# Altium schematic sheet Connectors.SchDoc: Extension connectors
size A3; DocumentNumber: MB1137; Revision: B-01; SheetNumber: 6; SheetTotal: 6; Project: NUCLEO-XXXXZX
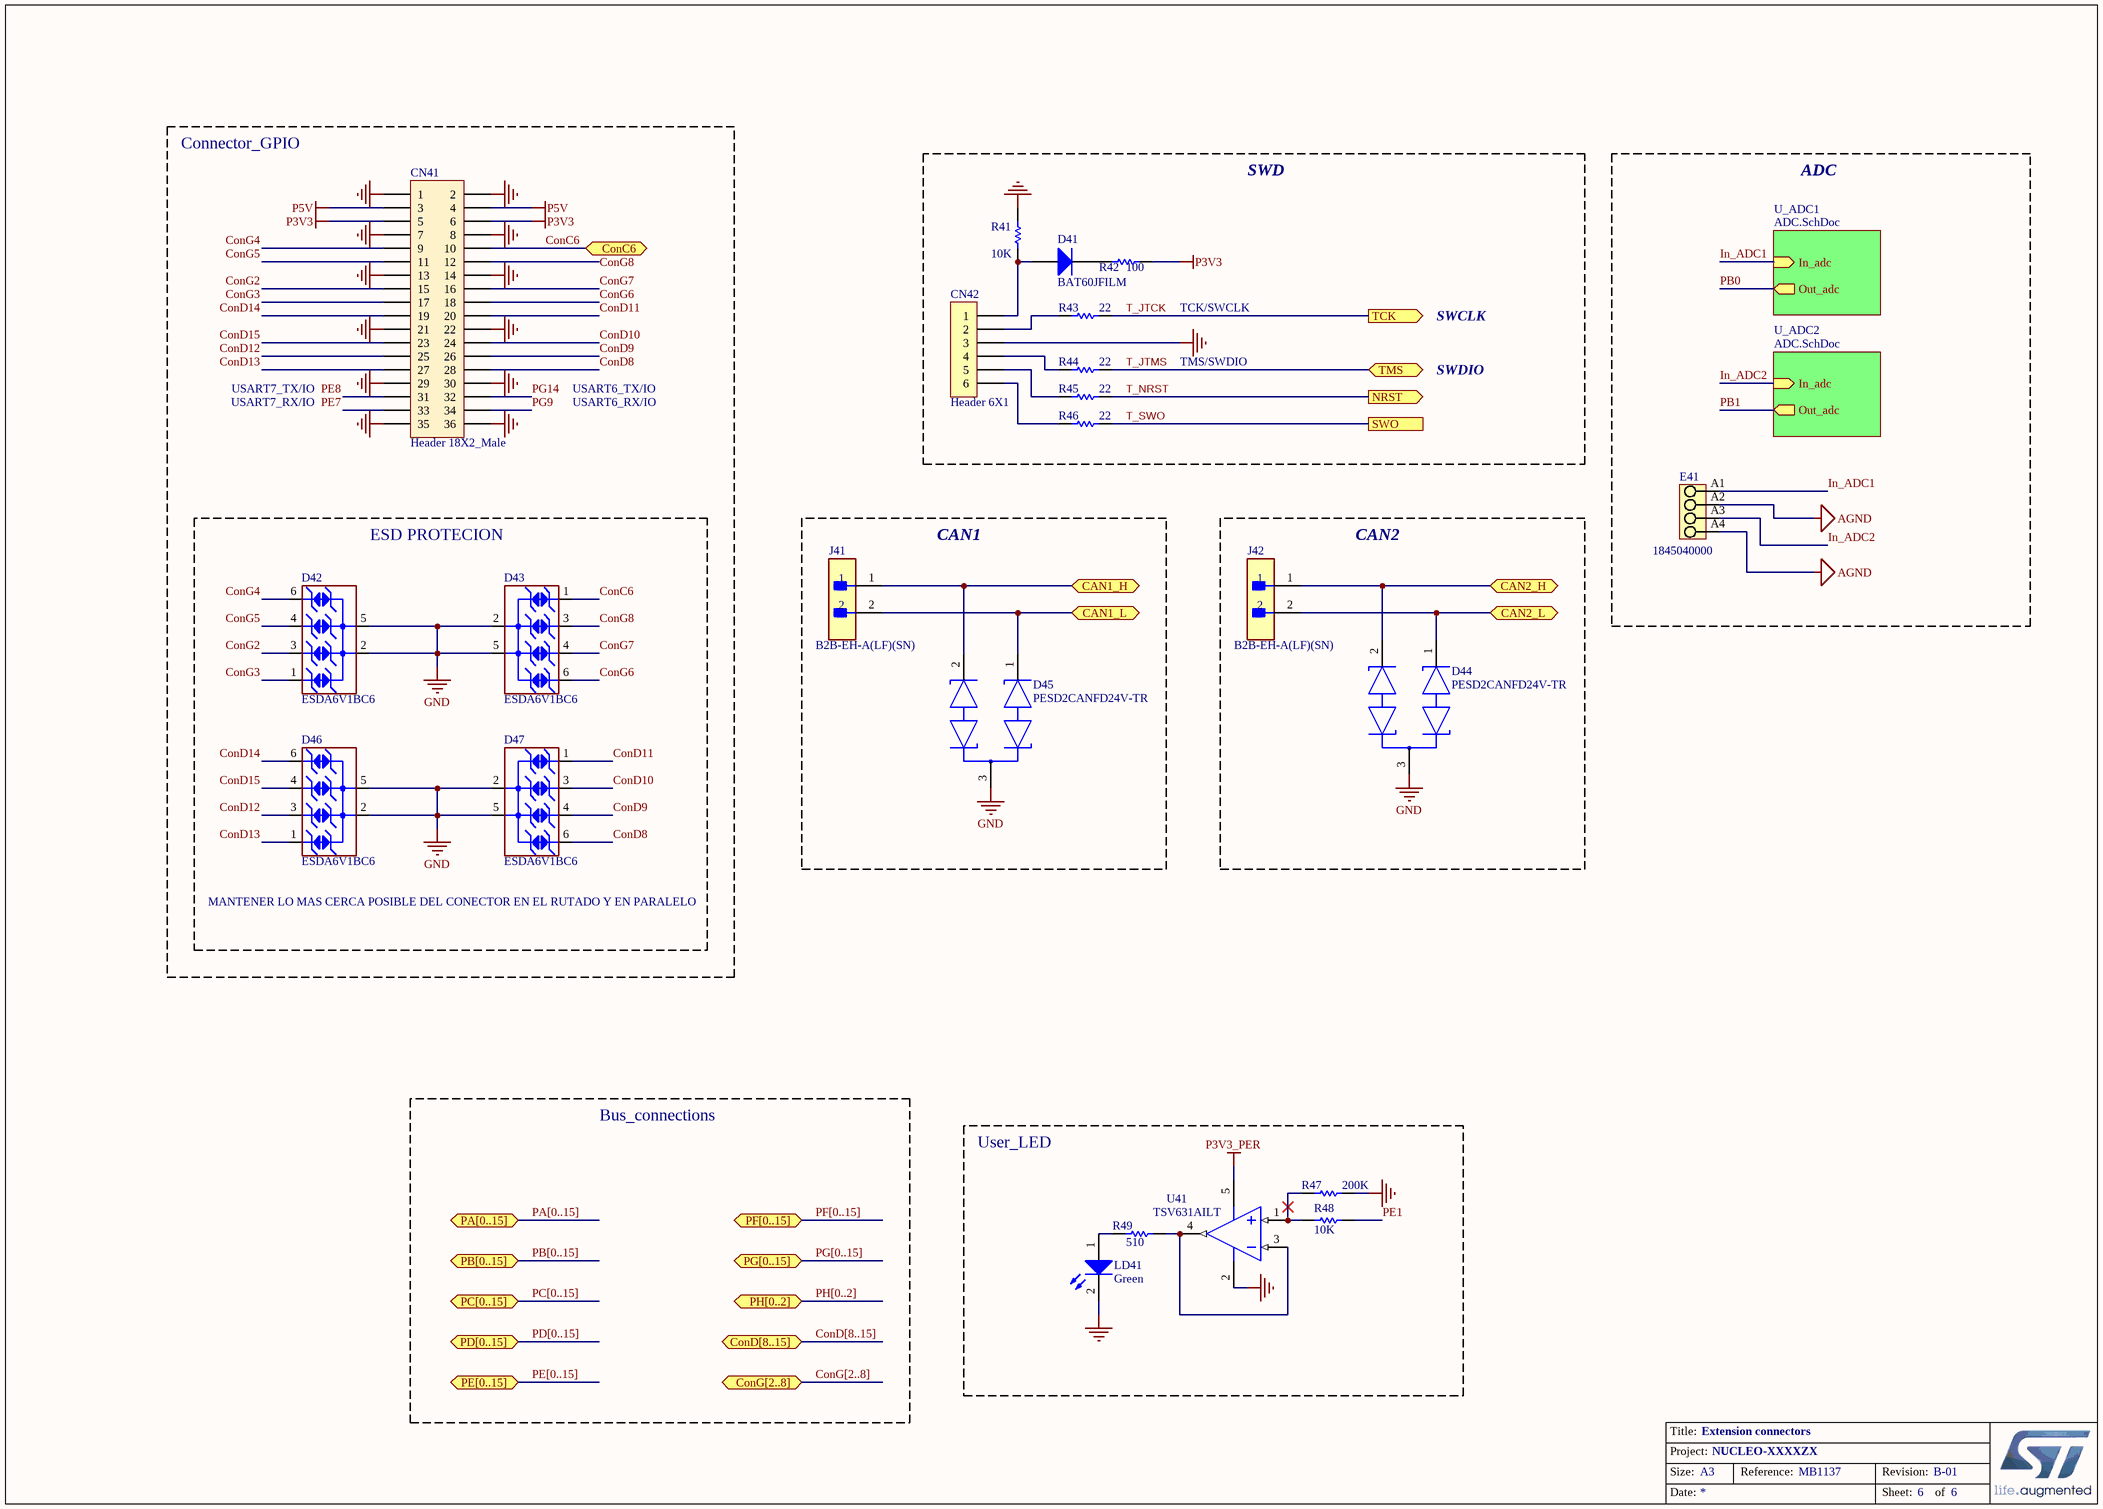
[diagram p0: Connectors.SchDoc]

## Parts
CN41  Header 18X2_Male  [HDR_2x18_2R54_V_M]
CN42  Header 6X1  [HDR_1x6_2R54_V_M]
D41  BAT60JFILM  [SOD-323]
D42  ESDA6V1BC6  [SOT23-6L]
D43  ESDA6V1BC6  [SOT23-6L]
D44  PESD2CANFD24V-TR  [FP-SOT23-IPC_A]
D45  PESD2CANFD24V-TR  [FP-SOT23-IPC_A]
D46  ESDA6V1BC6  [SOT23-6L]
D47  ESDA6V1BC6  [SOT23-6L]
E41  1845040000  [LM_3_5_90_04]
J41  B2B-EH-A(LF)(SN)  [FP-B2B-EH-A_LF_SN-MFG]
J42  B2B-EH-A(LF)(SN)  [FP-B2B-EH-A_LF_SN-MFG]
LD41  Green  [0603D-G]
R41  10K  [0603R]
R42  100  [0603R]
R43  22  [0603R]
R44  22  [0603R]
R45  22  [0603R]
R46  22  [0603R]
R47  200K  [0603R]
R48  10K  [0603R]
R49  510  [0603R]
U41  TSV631AILT  [SOT-23-5L]

## Blocks framed on the sheet
Connector_GPIO: CN41
SWD: CN42 D41 R41-R46
ADC: E41
ESD PROTECION: D42 D43 D46 D47
CAN1: D45 J41
CAN2: D44 J42
User_LED: LD41 R47-R49 U41

## Sub-sheets
U_ADC1 = ADC.SchDoc: In_adc (in), Out_adc (out)
U_ADC2 = ADC.SchDoc: In_adc (in), Out_adc (out)

## Ports
CAN1_H (bidir), CAN1_L (bidir), CAN2_H (bidir), CAN2_L (bidir), ConC6 (bidir), ConD[8..15] (bidir), ConG[2..8] (bidir), NRST (out), PA[0..15] (bidir), PB[0..15] (bidir), PC[0..15] (bidir), PD[0..15] (bidir), PE[0..15] (bidir), PF[0..15] (bidir), PG[0..15] (bidir), PH[0..2] (bidir), SWO, TCK (out), TMS (bidir)

## Nets
AGND: E41.A2 E41.A4
GND: CN41.1 CN41.2 CN41.7 CN41.8 CN41.13 CN41.14 CN41.21 CN41.22 CN41.29 CN41.30 CN41.35 CN41.36 CN42.3 D42.2(IO2) D42.5(IO4) D43.2(IO2) D43.5(IO4) D44.3(CC) D45.3(CC) D46.2(IO2) D46.5(IO4) D47.2(IO2) D47.5(IO4) LD41.2(K) R41.2 R47.2 U41.2(VDD)
P3V3: CN41.5 CN41.6 R42.2
P3V3_PER: U41.5(VCC)
P5V: CN41.3 CN41.4
CAN1_H: D45.2(K2) J41.1 ; port CAN1_H
CAN1_L: D45.1(K1) J41.2 ; port CAN1_L
CAN2_H: D44.2(K2) J42.1 ; port CAN2_H
CAN2_L: D44.1(K1) J42.2 ; port CAN2_L
ConC6: CN41.10 D43.1(IO1) ; port ConC6
ConD8: CN41.28 D47.6(NC)
ConD9: CN41.26 D47.4(IO3)
ConD10: CN41.24 D47.3(GND)
ConD11: CN41.20 D47.1(IO1)
ConD12: CN41.25 D46.3(GND)
ConD13: CN41.27 D46.1(IO1)
ConD14: CN41.19 D46.6(NC)
ConD15: CN41.23 D46.4(IO3)
ConG2: CN41.15 D42.3(GND)
ConG3: CN41.17 D42.1(IO1)
ConG4: CN41.9 D42.6(NC)
ConG5: CN41.11 D42.4(IO3)
ConG6: CN41.18 D43.6(NC)
ConG7: CN41.16 D43.4(IO3)
ConG8: CN41.12 D43.3(GND)
In_ADC1: E41.A1 ; sheet U_ADC1/In_adc
In_ADC2: E41.A3 ; sheet U_ADC2/In_adc
PB0: sheet U_ADC1/Out_adc
PB1: sheet U_ADC2/Out_adc
PE1: R48.2
PE7: CN41.33
PE8: CN41.31
PG9: CN41.34
PG14: CN41.32
T_JTCK: R43.2 ; port TCK
T_JTMS: R44.2 ; port TMS
T_NRST: R45.2 ; port NRST
T_SWO: R46.2 ; port SWO
NetCN42_1: CN42.1 D41.1(A) R41.1
NetCN42_2: CN42.2 R43.1
NetCN42_4: CN42.4 R44.1
NetCN42_5: CN42.5 R45.1
NetCN42_6: CN42.6 R46.1
NetD41_2: D41.2(K) R42.1
NetLD41_1: LD41.1(A) R49.2
NetR47_1: R47.1 R48.1 U41.1(IN+)
NetR49_1: R49.1 U41.3(IN-) U41.4(OUT)

## Buses and harness runs
bus ConD[8..15] = port ConD[8..15]
bus ConG[2..8] = port ConG[2..8]
bus PA[0..15] = port PA[0..15]
bus PB[0..15] = port PB[0..15]
bus PC[0..15] = port PC[0..15]
bus PD[0..15] = port PD[0..15]
bus PE[0..15] = port PE[0..15]
bus PF[0..15] = port PF[0..15]
bus PG[0..15] = port PG[0..15]
bus PH[0..2] = port PH[0..2]

## Notes on the sheet
- TCK/SWCLK
- SWCLK
- TMS/SWDIO
- SWDIO
- USART7_TX/IO
- USART7_RX/IO
- USART6_TX/IO
- USART6_RX/IO
- MANTENER LO MAS CERCA POSIBLE DEL CONECTOR EN EL RUTADO Y EN PARALELO
- Bus_connections
- Title:
- Project:
- Size:
- Date:
- A3
- Reference:
- Sheet:
- Revision:
- of

## Library data of the parts
CN41 = Header 18X2_Male: Header, 18-Pin, Dual row,male; Publisher: Altium Limited
CN42 = Header 6X1: Header, 6-Pin, Single row; LatestRevisionDate: 17-Jul-2002; LatestRevisionNote: Re-released for DXP Platform.; Publisher: Altium Limited
D41 = BAT60JFILM: Manuf_1: STM; Provided: ST; ECCN_US/EU: EAR99/NEC; Revision: July-2002: Re-released for DXP Platform.; Order: BAT60JFILM; Manuf_Part_1: BAT60JFILM; Distrib: ST
D42 D43 D46 D47 = ESDA6V1BC6: 4-line ESD protection; Manuf_1: STM; Manuf_Part_1: ESDA5V3L; Ref St: 9179034; Provided: ST; ECCN_US/EU: EAR99/NEC; Distrib: ST; Order: ESDA5V3L; Ordered by: STM
D44 D45 = CMP-14436-000014-1: TVS DIODE 24VWM 42VC TO236AB
E41 = CMP-1559-01732-1: OMNIMATE Signal - series LM; Manufacturer: Weidmueller; Rated_voltage_use_group_B_UL_1059: 300 V; Short_text_for_material: LM 3.50/04/90 3.2SN OR BX; Wire_cross_section_AWG_min_UL_1059: AWG 28; Pitch_mm: 3,5 mm; Solder_pin_length_mm: 3,2 mm; Contact_material: Cu-Leg; Rated_current_min_no_of_poles_TU_20_deg_C: 19 A; Rated_current_use_group_B_UL_1059: 10 A; Side_termination_characteristic: closed side; Contact_surface: tinned; UL_94_flammability_rating: V-2; Pitch_inch: 0,138 inch; Insulating_material: PA; Solid_max_H05_07_V_U: 1,5 mm²; Rated_voltage_for_surge_voltage_class_pollution_degree_II_2: 320 V; Wire_cross_section_AWG_max_UL_1059: AWG 14; Mounting_onto_the_PCB: Solder connection; Solid_min_H05_07_V_U: 0,5 mm²; No_of_poles: 4; ComponentLink2Description: URL Link1; ComponentLink2URL: http://catalog.weidmueller.com/catalog/Start.do?localeId=en&ObjectID=1845040000; Qty: 100 PCS; Packaging: Box; Revision: V1; PartNumber: 1845040000; ComponentLink1Description: Manufacturer URL; ComponentLink1URL: http://www.weidmueller.com/; PackageReference: LM_3_5_90_04; Colour: Orange
J41 J42 = CMP-17439-000026-1: CONN HEADER VERT 2POS 2.5MM; Number of Contacts: 2; Current Rating: 3A; Connector Type: Plug; Contact Resistance: 20mR; Gender: Male; Voltage Rating: 250V; Fastening Type: Detent; Depth: 3.8mm; Max Operating Temperature: 85°C; Orientation: Straight; Series: EH; Contact Plating: Tin; Min Operating Temperature: -25°C; Contact Type: Male Pin; Housing Color: White; Termination: Press-Fit; Housing Material: Nylon; Pitch: 2.5mm; Number of Positions: 2; Max Current Rating: 3A; Packaging: Bulk; Lead Free: Lead Free; Number of Rows: 1; Length: 7.5mm; Contact Mating Length: 0.13inch; Color: Natural; Max Voltage Rating (AC): 250V; Contact Material: Copper Alloy; Mount: Through Hole
LD41 = LED2: Typical RED, GREEN, YELLOW, AMBER GaAs LED; Published: 8-Jun-2000; Revision: July-2002: Re-released for DXP Platform.; Publisher: Altium Limited
R41 = Resistor_ST: Resistor 0402 / 0603 / 0805; Value: 10K
R42-R46 = Resistor_ST: Resistor 0402 / 0603 / 0805; Value: 10K
R47 R48 = res1: Resistor; Value: 1K; Published: 8-Jun-2000; Revision: July-2002: Re-released for DXP Platform.; Publisher: Altium Limited
R49 = Res1: Resistor; Value: 1K; Published: 8-Jun-2000; Revision: July-2002: Re-released for DXP Platform.; Publisher: Altium Limited